# EAGLE schematic Mono_rev0 (EAGLE 7.5.0)
Glow driver for 1 cyl with C, Amp, Volt, RPM, airspeed, bluetooth, display, logging
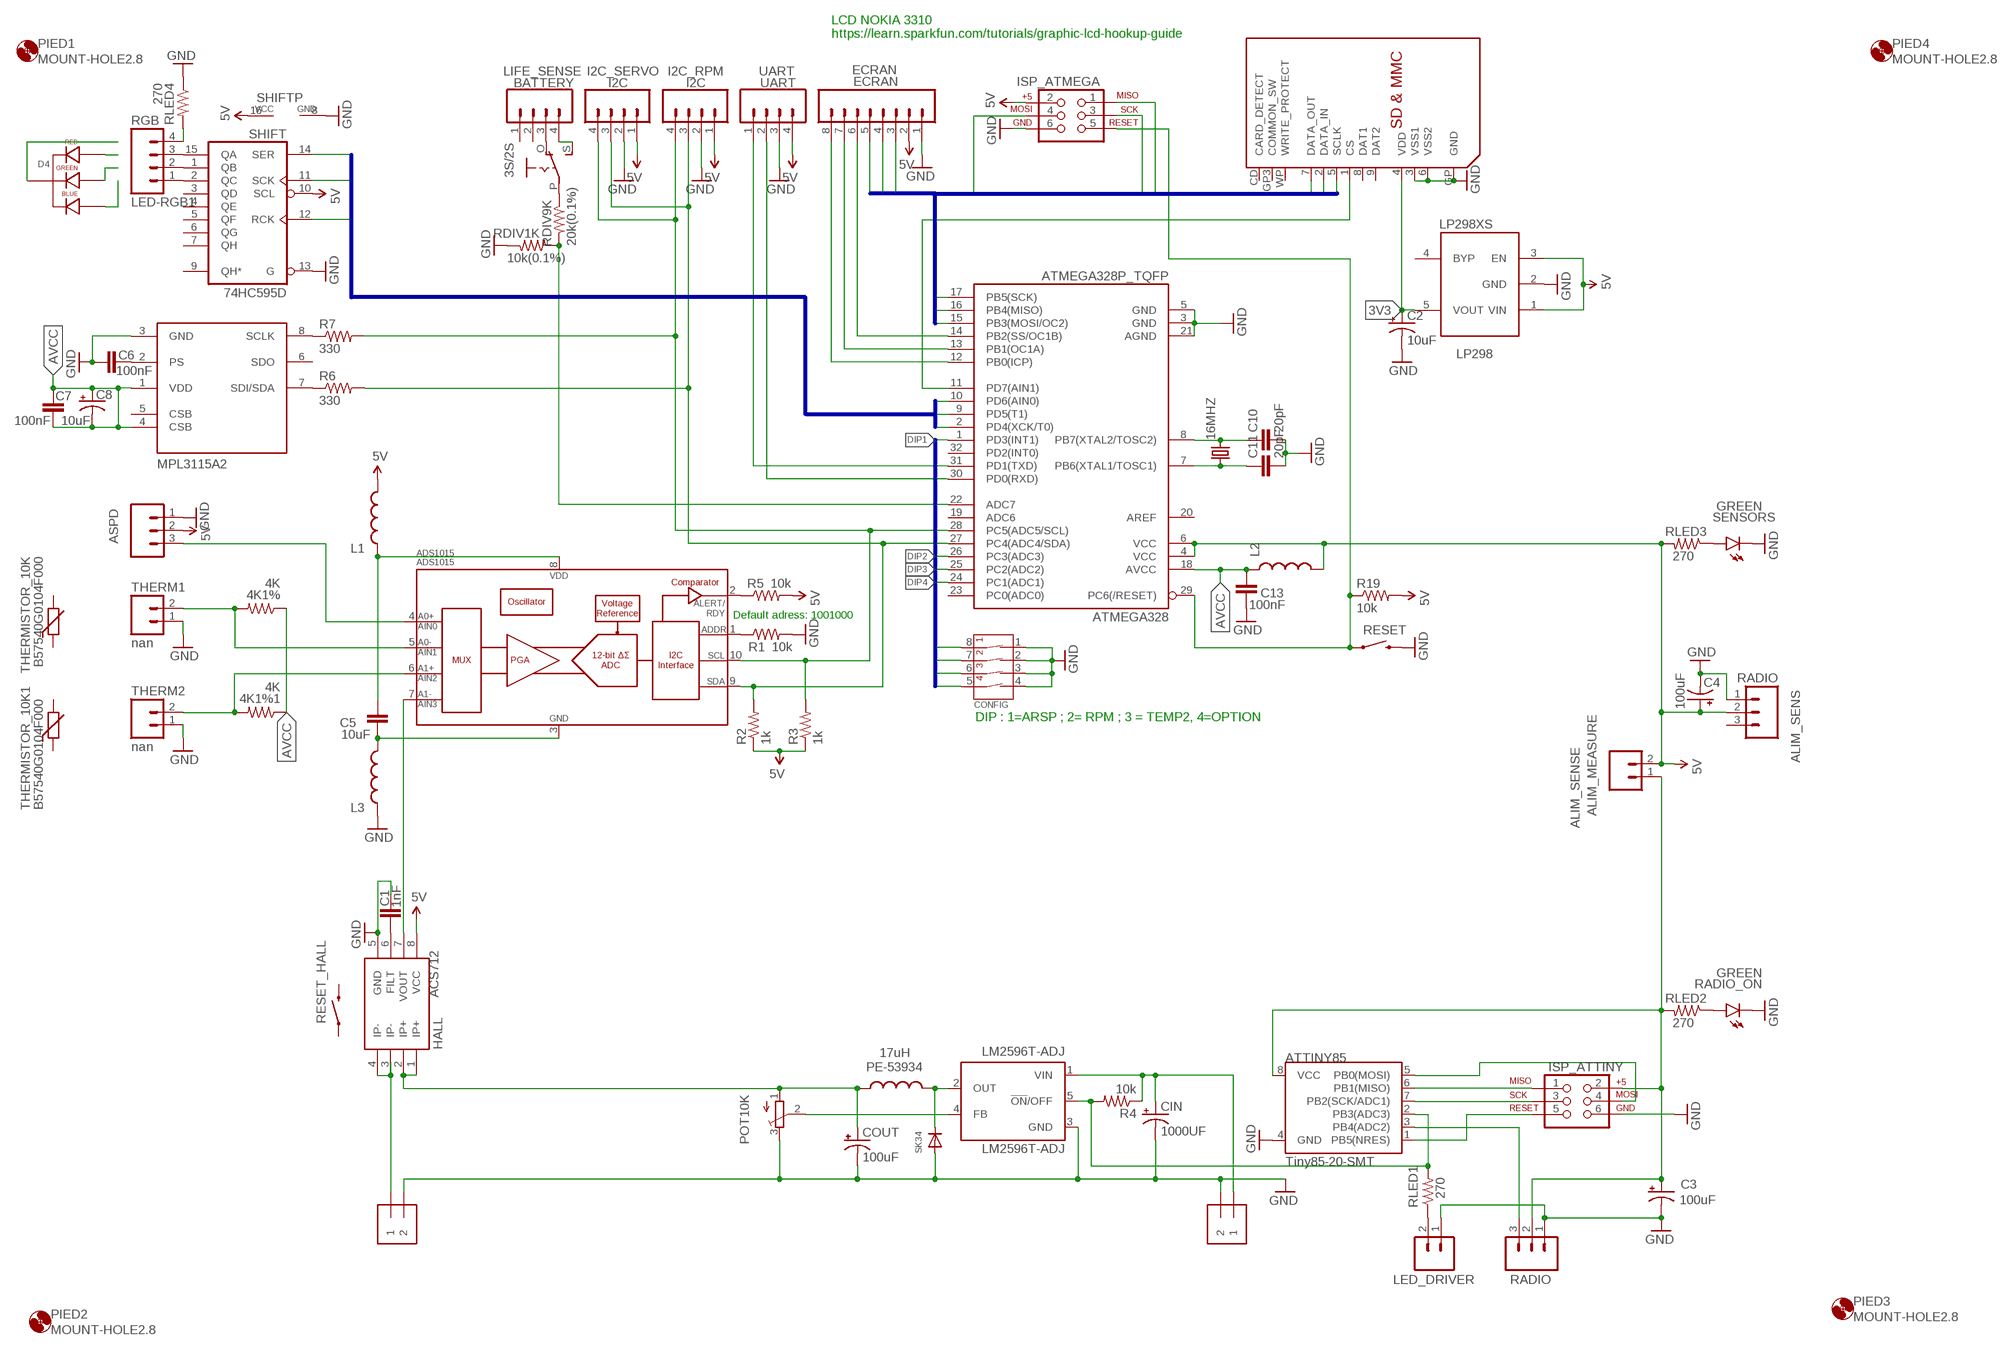
[diagram p0: schematic, sheet 1]

## Parts
3S/2S  EG1218S  [EG1218]
4K1%  4K  RESISTOR0805-RES  [0805]
4K1%1  4K  RESISTOR0805-RES  [0805]
16MHZ  CRYSTALHC49US  [HC49US]
ADS1015  ADS1015  [MSOP10]
ALIM_SENS  RADIO  M03PTH  [1X03]
ALIM_SENSE  ALIM_MEASURE  M02PTH  [1X02]
ASPD  M03PTH  [1X03]
ATMEGA328  ATMEGA328P_TQFP  [TQFP32-08]
ATTINY85  Tiny85-20-SMT  ATTINY45TINY85-20-SMT  [SO08-EIAJ]
C1  1nF  CAP0805  [0805]
C2  10uF  CPOL-USA/3216-18R  [A/3216-18R]
C3  100uF  CPOL-USCT3216  [CT3216]
C4  100uF  CPOL-USCT3216  [CT3216]
C5  10uF  CAP0805  [0805]
C6  100nF  CAP0805  [0805]
C7  100nF  CAP0805  [0805]
C8  10uF  CAP_POL1206  [EIA3216]
C10  20pF  CAP0805  [0805]
C11  20pF  CAP0805  [0805]
C13  100nF  CAP0805  [0805]
CIN  1000UF  CPOL-USG  [PANASONIC_G]
CONFIG  4-POS-DIP  [4-POS-DIP-SMD]
COUT  100uF  100UF-10V-10%(TANT)  [EIA7343]
D4  LED-RGB-CC-THRUDIFFUSE  [LED-RGB-THRU]
ECRAN  ECRAN  M08SILK_FEMALE_PTH  [1X08]
GLOW  1X2-3.5MM  [1X2-3.5MM]
HALL  ACS712  [SO08]
I2C_RPM  I2C  M04PTH  [1X04]
I2C_SERVO  I2C  M04PTH  [1X04]
ISP_ATMEGA  AVR_SPI_PRG_6PTH  [2X3]
ISP_ATTINY  AVR_SPI_PRG_6PTH  [2X3]
L1  INDUCTOR0805  [0805]
L2  INDUCTOR0805  [0805]
L3  INDUCTOR0805  [0805]
LED_DRIVER  M02PTH  [1X02]
LIFE  1X2-3.5MM  [1X2-3.5MM]
LIFE_SENSE  BATTERY  M04PTH  [1X04]
LM2596T-ADJ  LM2596T-ADJ  LM2596T  [T05D]
LP298  LP298XS  [SOT23-5L]
MPL3115A2  MS5611-01BA03  [SON125P300X500X100-8N]
PE-53934  17uH  PE-53934  [LCI-44]
PIED1  MOUNT-HOLE2.8  [2,8]
PIED2  MOUNT-HOLE2.8  [2,8]
PIED3  MOUNT-HOLE2.8  [2,8]
PIED4  MOUNT-HOLE2.8  [2,8]
POT10K  TRIMPOTTC33X  [TC33X]
R1  10k  RESISTOR0805-RES  [0805]
R2  1k  RESISTOR0805-RES  [0805]
R3  1k  RESISTOR0805-RES  [0805]
R4  10k  RESISTOR0805-RES  [0805]
R5  10k  RESISTOR0805-RES  [0805]
R6  330  RESISTOR0805-RES  [0805]
R7  330  RESISTOR0805-RES  [0805]
R19  10k  RESISTOR0805-RES  [0805]
RADIO  M03PTH  [1X03]
RADIO_ON  GREEN  LED-GREEN1206  [LED-1206]
RDIV1K  10k(0.1%)  RESISTOR0805-RES  [0805]
RDIV9K  20k(0.1%)  RESISTOR0805-RES  [0805]
RESET  SWITCH-MOMENTARY-2SMD-1101NE  [TACTILE-SWITCH-1101NE]
RESET_HALL  SWITCH-MOMENTARY-2SMD-1101NE  [TACTILE-SWITCH-1101NE]
RGB  LED-RGB1  M04PTH  [1X04]
RLED1  270  RESISTOR0805-RES  [0805]
RLED2  270  RESISTOR0805-RES  [0805]
RLED3  270  RESISTOR0805-RES  [0805]
RLED4  270  RESISTOR0805-RES  [0805]
SENSORS  GREEN  LED-GREEN1206  [LED-1206]
SHIFT  74HC595D  [SO16]
SK34  DIODESMA  [SMADIODE]
THERM1  nan  M02PTH  [1X02]
THERM2  nan  M02PTH  [1X02]
THERMISTOR_10K  B57540G0104F000  THERMISTOR-2,5  [RS-2,5]
THERMISTOR_10K1  B57540G0104F000  THERMISTOR-2,5  [RS-2,5]
U$1  SDMMC06132  [06132]
UART  UART  M04PTH  [1X04]

## Nets
3V3: C2.+ LP298.5(VOUT) U$1.4(VDD)
5V: ALIM_SENS.2 ALIM_SENSE.2 ASPD.2 ATMEGA328.4(VCC) ATMEGA328.6(VCC) C4.+ ECRAN.2 HALL.8(VCC) I2C_RPM.1 I2C_SERVO.1 ISP_ATMEGA.2 L1.2 L2.2 LP298.1(VIN) LP298.3(EN) R2.1 R3.1 R5.2 R19.2 RLED3.2 SHIFT.10(SCL) SHIFT.16(VCC) UART.4
AVCC: 4K1%1.1 4K1%.1 ATMEGA328.18(AVCC) C7.1 C7.2 C8.A(+) C8.C(-) C13.1 L2.1 MPL3115A2.1(VDD) MPL3115A2.4(CSB)
DIP1: ATMEGA328.1(PD3(INT1)) CONFIG.8(1B)
DIP2: ATMEGA328.26(PC3(ADC3)) CONFIG.7(2B)
DIP3: ATMEGA328.25(PC2(ADC2)) CONFIG.6(3B)
DIP4: ATMEGA328.24(PC1(ADC1)) CONFIG.5(4B)
GND: ALIM_SENS.1 ASPD.1 ATMEGA328.3(GND) ATMEGA328.5(GND) ATMEGA328.21(AGND) ATTINY85.4(GND) C1.1 C2.- C3.- C4.- C6.1 C10.2 C11.2 C13.2 CIN.- CONFIG.1(1A) CONFIG.2(2A) CONFIG.3(3A) CONFIG.4(4A) COUT.C(-) ECRAN.1 GLOW.2 HALL.5(GND) I2C_RPM.2 I2C_SERVO.2 ISP_ATMEGA.6 ISP_ATTINY.6 L3.1 LED_DRIVER.1 LIFE.2 LM2596T-ADJ.3(GND) LP298.2(GND) MPL3115A2.3(GND) POT10K.3(E) R1.2 RADIO.1 RADIO_ON.C RESET.2 RLED4.1 SENSORS.C SHIFT.8(GND) SHIFT.13(G) SK34.A THERM1.1 THERM2.1 UART.3
LED: LED_DRIVER.2 RLED1.1
MISO: ATMEGA328.16(PB4(MISO)) ECRAN.4 ISP_ATMEGA.1 U$1.7(DATA_OUT)
MOSI: ATMEGA328.15(PB3(MOSI/OC2)) ECRAN.5 ISP_ATMEGA.4 U$1.2(DATA_IN)
N$1: D4.3(GREEN_CATHODE)
N$2: ATMEGA328.11(PD7(AIN1)) U$1.1(CS)
N$3: D4.4(BLUE_CATHODE)
N$4: RLED3.1 SENSORS.A
N$5: RADIO_ON.A RLED2.1
N$6: RGB.4 RLED4.2
N$7: 4K1%1.2 ADS1015.6(AIN2) THERM2.2
N$8: ADS1015.7(AIN3) HALL.7(VOUT)
N$9: LM2596T-ADJ.2(OUT) PE-53934.P$2 SK34.C
N$10: D4.1(RED_CATHODE)
N$11: ATMEGA328.29(PC6(/RESET)) ISP_ATMEGA.5 R19.1 RESET.1
N$12: LM2596T-ADJ.4(FB) POT10K.2(S)
N$13: D4.2(CATHODE)
N$14: GLOW.1 HALL.3(IP-) HALL.4(IP-)
N$15: ADS1015.1(ADDR) R1.1
N$16: ATMEGA328.14(PB2(SS/OC1B)) ECRAN.6
N$17: ATMEGA328.13(PB1(OC1A)) ECRAN.7
N$18: ATMEGA328.12(PB0(ICP)) ECRAN.8
N$19: ADS1015.3(VSS) C5.2 L3.2
N$20: 4K1%.2 ADS1015.5(AIN1) THERM1.2
N$21: ADS1015.8(VDD) C5.1 L1.1
N$22: ADS1015.2(ALERT/RDY) R5.1
N$23: 3S/2S.O LIFE_SENSE.3
N$24: 3S/2S.S LIFE_SENSE.4
N$25: ATMEGA328.22(ADC7) RDIV1K.1 RDIV9K.2
N$26: ADS1015.4(AIN0) ASPD.3
N$27: MPL3115A2.8(SCLK) R7.1
N$28: 3S/2S.P RDIV9K.1
N$29: MPL3115A2.7(SDI/SDA) R6.1
N$30: C6.2 MPL3115A2.2(PS)
N$31: RGB.1 SHIFT.2(QC)
N$32: RGB.2 SHIFT.1(QB)
N$33: ATTINY85.5(PB0(MOSI)) ISP_ATTINY.4
N$34: ATTINY85.6(PB1(MISO)) ISP_ATTINY.1
N$35: ATTINY85.7(PB2(SCK/ADC1)) ISP_ATTINY.3
N$36: ATTINY85.2(PB3(ADC3)) LM2596T-ADJ.5(!ON!/OFF) R4.2 RLED1.2
N$38: RGB.3 SHIFT.15(QA)
N$44: CIN.+ LIFE.1 LM2596T-ADJ.1(VIN) R4.1
N$45: ALIM_SENSE.1 ATTINY85.8(VCC) C3.+ ISP_ATTINY.2 RADIO.2 RLED2.2
N$48: ADS1015.10(SCL) ATMEGA328.28(PC5(ADC5/SCL)) I2C_RPM.4 I2C_SERVO.4 R3.2 R7.2
N$49: ADS1015.9(SDA) ATMEGA328.27(PC4(ADC4/SDA)) I2C_RPM.3 I2C_SERVO.3 R2.2 R6.2
N$55: C1.2 HALL.6(FILT)
N$74: 16MHZ.2 ATMEGA328.8(PB7(XTAL2/TOSC2)) C10.1
N$75: 16MHZ.1 ATMEGA328.7(PB6(XTAL1/TOSC1)) C11.1
N$89: ATMEGA328.31(PD1(TXD)) UART.1
N$92: ATMEGA328.30(PD0(RXD)) UART.2
N$110: ATTINY85.1(PB5(NRES)) ISP_ATTINY.5
N$112: ATTINY85.3(PB4(ADC2)) RADIO.3
POT10K: COUT.A(+) HALL.1(IP+) HALL.2(IP+) PE-53934.P$1 POT10K.1(A)
RCK: ATMEGA328.10(PD6(AIN0)) SHIFT.12(RCK)
RDIV1K: RDIV1K.2 ; supply symbol labelled GND
SCK: ATMEGA328.9(PD5(T1)) ATMEGA328.17(PB5(SCK)) ECRAN.3 ISP_ATMEGA.3 SHIFT.11(SCK) U$1.5(SCLK)
SER: ATMEGA328.2(PD4(XCK/T0)) SHIFT.14(SER)
VSS2: U$1.3(VSS1) U$1.6(VSS2) U$1.GP(GND) ; supply symbol labelled GND
Unconnected: ALIM_SENS.3 ATMEGA328.19(ADC6) ATMEGA328.20(AREF) ATMEGA328.23(PC0(ADC0)) ATMEGA328.32(PD2(INT0)) LIFE_SENSE.1 LIFE_SENSE.2 LP298.4(BYP) MPL3115A2.5(CSB) MPL3115A2.6(SDO) RESET_HALL.1 RESET_HALL.2 SHIFT.3(QD) SHIFT.4(QE) SHIFT.5(QF) SHIFT.6(QG) SHIFT.7(QH) SHIFT.9(QH*) THERMISTOR_10K1.1 THERMISTOR_10K1.2 THERMISTOR_10K.1 THERMISTOR_10K.2 U$1.8(DAT1) U$1.9(DAT2) U$1.CD(CARD_DETECT) U$1.GP3(COMMON_SW) U$1.WP(WRITE_PROTECT)

## Buses
DIP[1..4]
RCK,SCK,SER
SCK,MISO,MOSI

## Notes on the sheet
- LCD NOKIA 3310
  https://learn.sparkfun.com/tutorials/graphic-lcd-hookup-guide
- Default adress: 1001000
- DIP : 1=ARSP ; 2= RPM ; 3 = TEMP2, 4=OPTION

## Library data of the parts
3S/2S = adafruit:EG1218: SLIDING SWITCH 0.1" spacing through hole, vertical SPDT slide switch http://www.ladyada.net/library/pcb/eaglelibrary.html; DIGIKEY: 679-1854-ND
4K1% 4K1%1 = SparkFun-Passives:RESISTOR: Resistor Basic schematic elements and footprints for 0603, 1206, and PTH resistors.; DIGIKEY: 274XBK-ND
16MHZ = SparkFun-FreqCtrl:CRYSTAL: Various standard crystals. Proven footprints.; DIGIKEY: CTX1085-ND
ADS1015 = SparkFun-AnalogIC:ADS1015: 12-Bit Del-Sig ADC Four single-ended inputs or two differential inputs Internal PGA I2C interface 2.0-5.5V; DIGIKEY: 296-25227-1-ND; PROD_ID: IC-12239
ALIM_SENS ASPD RADIO = SparkFun-Connectors:M03: Header 3 Standard 3-pin 0.1" header. Use with straight break away headers (SKU : PRT-00116), right angle break away headers (PRT-00553), swiss pins (PRT-00743), machine pins (PRT-00117), and female headers (PRT-00115). Molex polarized connector foot print use with SKU : PRT-08232 with associated crimp pins and housings.; DIGIKEY: S1011EC-40-ND
ALIM_SENSE LED_DRIVER THERM1 THERM2 = SparkFun-Connectors:M02: Standard 2-pin 0.1" header. Use with - straight break away headers ( PRT-00116) - right angle break away headers (PRT-00553) - swiss pins (PRT-00743) - machine pins (PRT-00117) - female headers (PRT-00115) Molex polarized connector foot print use with: PRT-08233 with associated crimp pins and housings. 2.54_SCREWTERM for use with PRT-10571. 3.5mm Screw Terminal footprints for PRT-08084 5mm Screw Terminal footprints for use with PRT-08432; DIGIKEY: S1011EC-40-ND
ATMEGA328 = SparkFun-DigitalIC:ATMEGA328P_TQFP; DIGIKEY: ATMEGA328P-AU-ND; PROD_ID: IC-09069
ATTINY85 = SparkFun-DigitalIC:ATTINY45: Atmel 8-pin 2/4/8kB flash uC; DIGIKEY: ATTINY85-20SU-ND; PROD_ID: IC-09092
C1 = SparkFun-Capacitors:CAP: Capacitor Standard 0603 ceramic capacitor, and 0.1" leaded capacitor.; DIGIKEY: 490-11585-1-ND
C2 = adafruit:CPOL-US: POLARIZED CAPACITOR, American symbol
C3 C4 = adafruit:CPOL-US: POLARIZED CAPACITOR, American symbol; DIGIKEY: 478-1777-1-ND
C5 = SparkFun-Passives:CAP: Capacitor Standard 0603 ceramic capacitor, and 0.1" leaded capacitor.; DIGIKEY: 490-6472-1-ND
C6 C7 C13 = SparkFun-Passives:CAP: Capacitor Standard 0603 ceramic capacitor, and 0.1" leaded capacitor.; DIGIKEY: 490-12558-1-ND
C8 = SparkFun-Capacitors:CAP_POL: Capacitor Polarized These are standard SMD and PTH capacitors. Normally 10uF, 47uF, and 100uF in electrolytic and tantalum varieties. Always verify the external diameter of the through hole cap, it varies with capacity, voltage, and manufacturer. The EIA devices should be standard.; DIGIKEY: 478-4086-1-ND
C10 C11 = SparkFun-Passives:CAP: Capacitor Standard 0603 ceramic capacitor, and 0.1" leaded capacitor.; DIGIKEY: 399-8916-ND
CIN = adafruit:CPOL-US: POLARIZED CAPACITOR, American symbol; DIGIKEY: 493-3930-1-ND
CONFIG = SparkFun-Electromechanical:4-POS-DIP: 4 Position DIP Switch CTS series 219; PROD_ID: SWCH-12418
COUT = SparkFun-Capacitors:100UF-10V-10%(TANT): CAP-07890; DIGIKEY: 478-9193-1-ND; PROD_ID: CAP-07890
D4 = SparkFun-LED:LED-RGB-CC-THRU: RGB Through-hole common cathode LED SparkFun Storefront: COM-00105 (Clear) COM-09264 (Diffuse); DIGIKEY: 754-1492-ND; PROD_ID: DIO-09434
ECRAN = SparkFun-Connectors:M08: Header 8 Standard 8-pin 0.1" header. Use with straight break away headers (SKU : PRT-00116), right angle break away headers (PRT-00553), swiss pins (PRT-00743), machine pins (PRT-00117), and female headers (PRT-00115).; DIGIKEY: S1011EC-40-ND; PROD_ID: CONN-08438
GLOW LIFE = adafruit:1X2: 3.5mm Terminal block http://www.ladyada.net/library/pcb/eaglelibrary.html; DIGIKEY: ED1514-ND
HALL = SparkFun-AnalogIC:ACS712: Hall-effect-based isolated linear current sensor; DIGIKEY: 620-1189-1-ND; PROD_ID: IC-08964
I2C_RPM I2C_SERVO LIFE_SENSE RGB UART = SparkFun-Connectors:M04: Header 4 Standard 4-pin 0.1" header. Use with straight break away headers (SKU : PRT-00116), right angle break away headers (PRT-00553), swiss pins (PRT-00743), machine pins (PRT-00117), and female headers (PRT-00115). Molex polarized connector foot print use with SKU : PRT-08231 with associated crimp pins and housings. 1MM SMD Version SKU: PRT-10208; DIGIKEY: S1011EC-40-ND
ISP_ATMEGA ISP_ATTINY = SparkFun-Connectors:AVR_SPI_PRG_6: AVR ISP 6 Pin This is the reduced ISP connector for AVR programming. Common on Arduino. This footprint will take up less PCB space and can be used with a 10-pin to 6-pin adapter such as SKU: BOB-08508 **Special note about "TEST_POINT" package. The stop mask is on the top side, so if you want your programming test points to be on the bottom of your board, make sure to place this package on the bottom side of the board. This also ensure that the orientation to program from the bottom side will be correct.; DIGIKEY: 609-2423-ND
L1-L3 = SparkFun-Passives:INDUCTOR: Inductors Basic Inductor/Choke - 0603 and 1206. Footprints are not proven and vary greatly between part numbers. INDUCTOR POWER 3.3UH 4.0A SMD 0.197" L x 0.197" W x 0.177" H (5.00mm x 5.00mm x 4.50mm); DIGIKEY: MH2029-300YCT-ND
LM2596T-ADJ = national-semiconductor:LM2596: SIMPLE SWITCHER® Power Converter 150 kHz 3A Step-Down Voltage Regulator Source: http://www.national.com/ds/LM/LM2596.pdf; DIGIKEY: LM2596T-ADJ/NOPB-ND; MPN: LM2596T-ADJ/LF02; OC_FARNELL: 9494162; OC_NEWARK: 65K5910
LP298 = adafruit:LP298X; DIGIKEY: 296-18476-1-ND
MPL3115A2 = Measurement-Specialties:MS5611-01BA03: Variometer Module, with stainless steel cap; DIGIKEY: MPL3115A2-ND
PE-53934 = juju:PE-53934; DIGIKEY: 553-1417-ND
PIED1-PIED4 = holes:MOUNT-HOLE: MOUNTING HOLE with drill center marker
POT10K = adafruit:TRIMPOT: SMT trimmer potentiometer part number TC33X http://www.ladyada.net/library/eagle; DIGIKEY: TC33X-103ECT-ND
R1 R5 R19 = SparkFun-Passives:RESISTOR: Resistor Basic schematic elements and footprints for 0603, 1206, and PTH resistors.; DIGIKEY: P10KACT-ND
R2 R3 = SparkFun-Passives:RESISTOR: Resistor Basic schematic elements and footprints for 0603, 1206, and PTH resistors.; DIGIKEY: P1.0KECT-ND
R4 = SparkFun-Resistors:RESISTOR: Resistor Basic schematic elements and footprints for 0603, 1206, and PTH resistors.; DIGIKEY: P10KACT-ND
R6 R7 = SparkFun-Passives:RESISTOR: Resistor Basic schematic elements and footprints for 0603, 1206, and PTH resistors.; DIGIKEY: P330ACT-ND
RADIO_ON SENSORS = SparkFun-LED:LED-GREEN: Various green LEDs Green LEDs used in SFE Production 0603- DIO-00821 LARGE- DIO-00862 LILYPAD- DIO-09910; DIGIKEY: 404-1046-1-ND; PROD_ID: DIO-00862
RDIV1K RDIV9K = SparkFun-Passives:RESISTOR: Resistor Basic schematic elements and footprints for 0603, 1206, and PTH resistors.
RESET RESET_HALL = SparkFun-Electromechanical:SWITCH-MOMENTARY-2: Various NO switches- pushbuttons, reed, etc; PROD_ID: SWCH-00815
RLED1 = SparkFun-Resistors:RESISTOR: Resistor Basic schematic elements and footprints for 0603, 1206, and PTH resistors.; DIGIKEY: P270ACT-ND
RLED2-RLED4 = SparkFun-Passives:RESISTOR: Resistor Basic schematic elements and footprints for 0603, 1206, and PTH resistors.; DIGIKEY: P270ACT-ND
SHIFT = 74xx-eu:74*595: 8-bit SHIFT REGISTER, output latch; DIGIKEY: 568-1484-5-ND
SK34 = adafruit:DIODE: Diode SMADIODE - SMA Surface Mount Package 20V 1A Schottky Diode Digikey: 641-1014-6-ND DO-1N4148 - Through Hole Small Current Diode SOD-123 20V 1 A (.5mV Vf) Schottky Diode - Digikey: MBRX120TPMSCT-ND SOD-323 10V 570mA (.38mV Vf, 3ns) Schottky Diode - Digikey: ZLLS410CT-ND SOD-523 30V 30mA Schottky Diode (RB751S-40TE61) - Digikey: RB751S-40TE61CT-ND SOT23-R/W - SOT23 Package (R = Solder Paste/Reflow Ovens, W = Hand-Soldering) BAT54Film 40V 300mA - Digikey: 497-7162-1-ND; DIGIKEY: SK34A-TPCT-ND
THERMISTOR_10K THERMISTOR_10K1 = varistor:THERMISTOR: THERMISTOR; DIGIKEY: 495-2125-ND
U$1 = adafruit:SDMMC: SD MMC Card holder 4UCON part #06132 - easy to solder

## Net classes
0 default: width 0.254 mm, drill 0.61 mm, clearance 0.254 mm